# Altium schematic sheet SDCard.SchDoc: SD Card Schematic
size A4; Author: Zoe Goodward
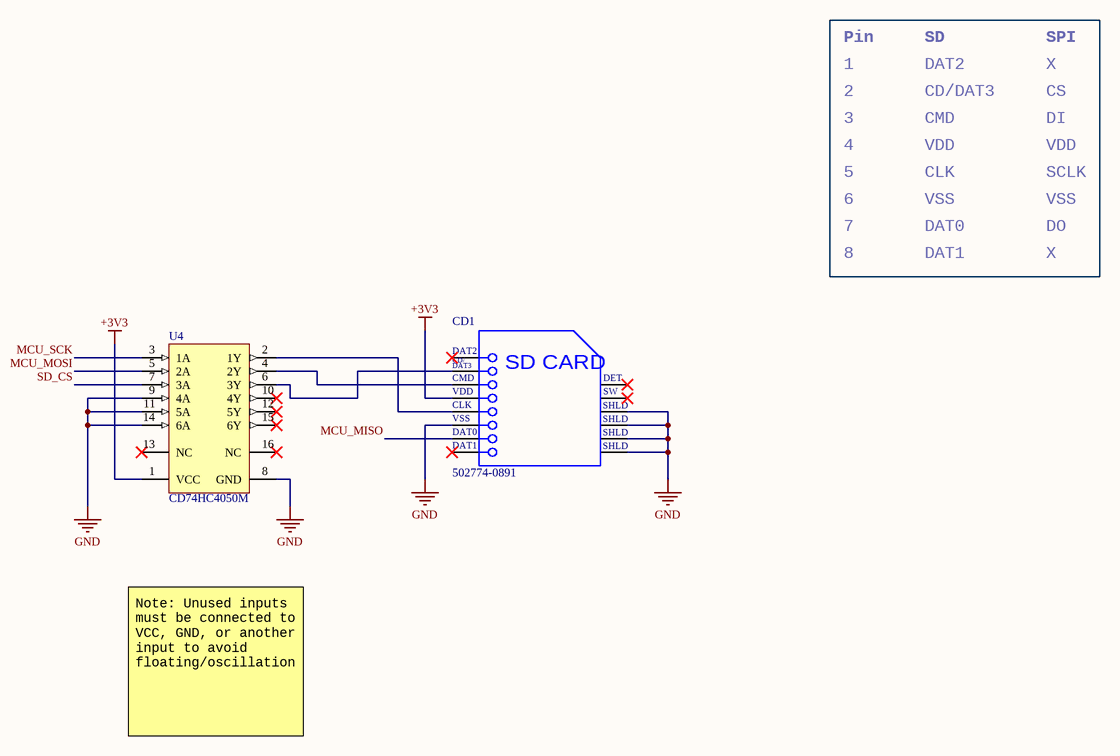
[diagram p0: SDCard.SchDoc]

## Parts
CD1  502774-0891  [MOLX-502774-0891_V]
U4  CD74HC4050M  [D0016A_N]

## Nets
+3V3: CD1.4(VDD) U4.1(VCC)
GND: CD1.6(VSS) CD1.11(SHLD) CD1.12(SHLD) CD1.13(SHLD) CD1.14(SHLD) U4.8(GND) U4.9(4A) U4.11(5A) U4.14(6A)
MCU_MISO: CD1.7(DAT0)
MCU_MOSI: U4.5(2A)
MCU_SCK: U4.3(1A)
SD_CS: U4.7(3A)
NetCD1_2: CD1.2(CD/DAT3) U4.6(3Y)
NetCD1_3: CD1.3(CMD) U4.4(2Y)
NetCD1_5: CD1.5(CLK) U4.2(1Y)

Not connected (* = marked no-connect by the designer): CD1 1(DAT2)* 8(DAT1)* 9(DETECT)* 10(SWITCH)*; U4 10(4Y)* 12(5Y)* 13(NC)* 15(6Y)* 16(NC)*

## Notes on the sheet
- Pin
- SD
- SPI
- 1
- 2
- DAT2
- CD/DAT3
- X
- CS
- 3
- 4
- 5
- CMD
- VDD
- CLK
- DI
- SCLK
- 6
- 7
- VSS
- DAT0
- DO
- 8
- DAT1
- Note: Unused inputs must be connected to VCC, GND, or another input to avoid floating/oscillation
- Title
- Size:
- Date:
- A4
- Number:
- Time:
- Revision:
- Sheet
- of
- File:
- (in symbol CMP-2000-05248-1) CD/; DAT3; SD CARD; DET; SW

## Library data of the parts
CD1 = CMP-2000-05248-1: Micro SD Memory Card Connector, 0.5 A, 10 V (DC), -25 to 85 degC, 8-Pin SMT, RoHS, Tape and Reel; Manufacturer: Molex; 3D Model: 502774-0891.stp; Online Catalog: microSD™Series; Number of Positions: 10(8+2); Card Type: SecureDigital-microSD™; Insertion, Removal Method: PushIn,PushOut; Other Names: WM24066DKR; Connector Type: ConnectorandEjector; Features: Switch; Family: MemoryConnectors-PCCardSockets; Manufacturer URL: http://www.molex.com/; Mounting Type: SurfaceMount,RightAngle; Contact Finish Thickness: 20µin(0.51µm); Standard Package: 1; Series: 502774; Ejector Side: -; Datasheet Version: Rev. D, 04/2004; Category: Connectors,Interconnects; Contact Finish: Gold; Datasheet URL: https://datasheet.ciiva.com/1104/1499551-1104671.pdf; RoHS Information: 502774-0891CertofCompliance; Mounting Feature: Reverse-Bottom; Packaging: Digi-Reel; Height Above Board: 0.071"(1.80mm); Catalog Drawings: 502774-0891
U4 = CMP-0440-00356-3: High Speed CMOS Logic Hex Non-Inverting Buffers, D0016A, TUBE; Manufacturer: Texas Instruments; F @ Nom Voltage(Max)(Mhz): 28; Voltage(Nom)(V): 6; VCC(Min)(V): 2; tpd @ Nom Voltage(Max)(ns): 18; ICC @ Nom Voltage(Max)(mA): 0.02; Rating: Catalog; PackageReference: D0016A; DatasheetVersion: SCHS205I; Output Type: CMOS; Operating Temperature Range(C): -55 to 125; Bits(#): 6; VCC(Max)(V): 6; PackageVersion: http://www.ti.com/lit/ml/mpds178g/mpds178g.pdf; Input Type: CMOS; Generic Part Number: CD74HC4050; Code_JEDEC: MS-012 variation AC